# EAGLE schematic GDPHS_VGA - v1.3 (EAGLE 7.3.0)

## Sheet 1 of 4
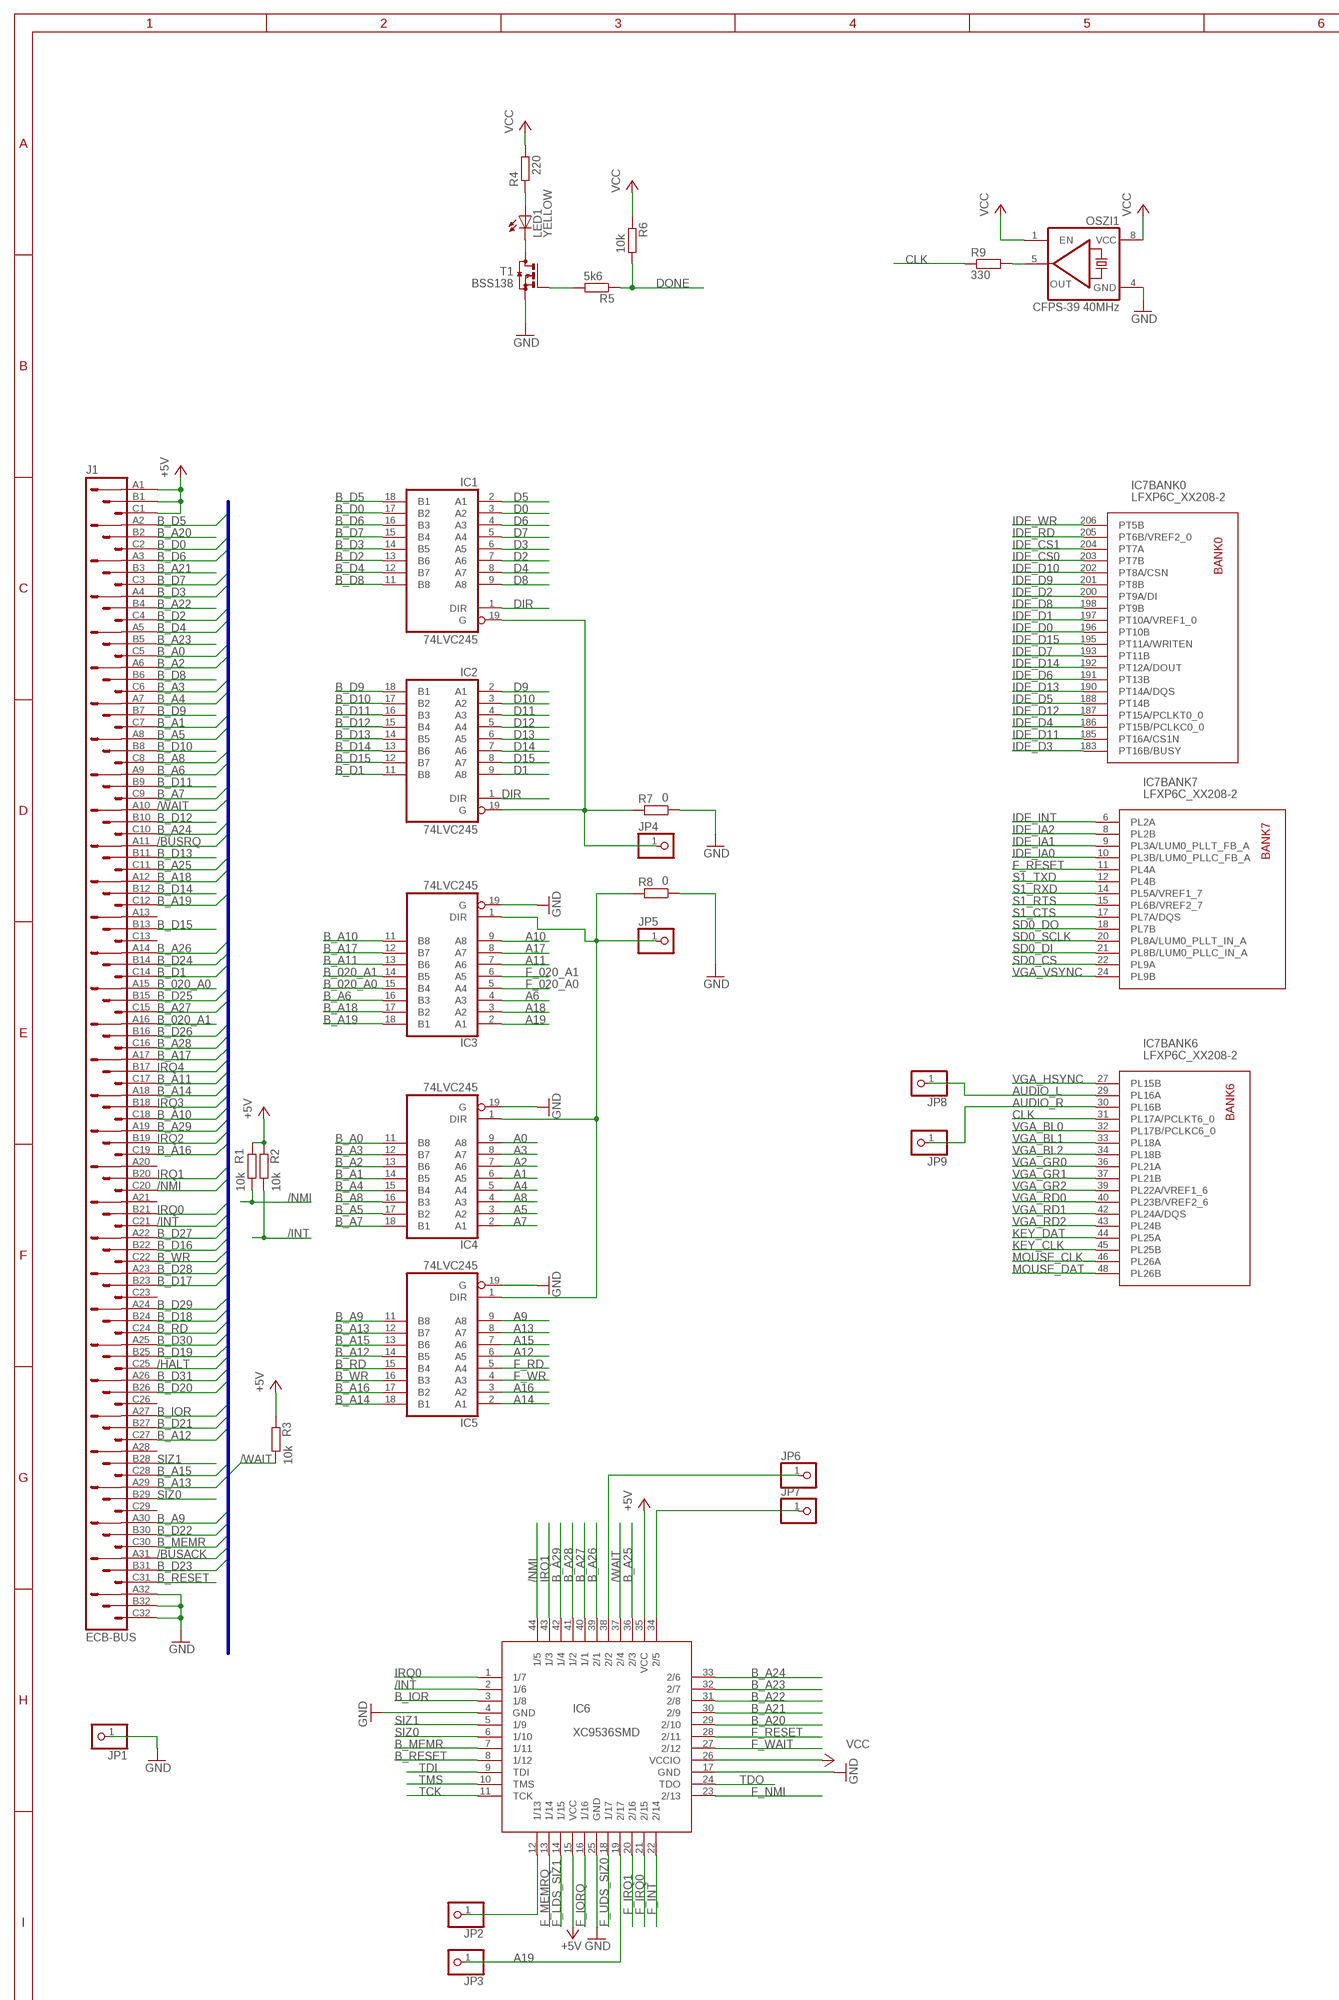
[diagram p0: schematic, sheet 1, part 1 of 2]
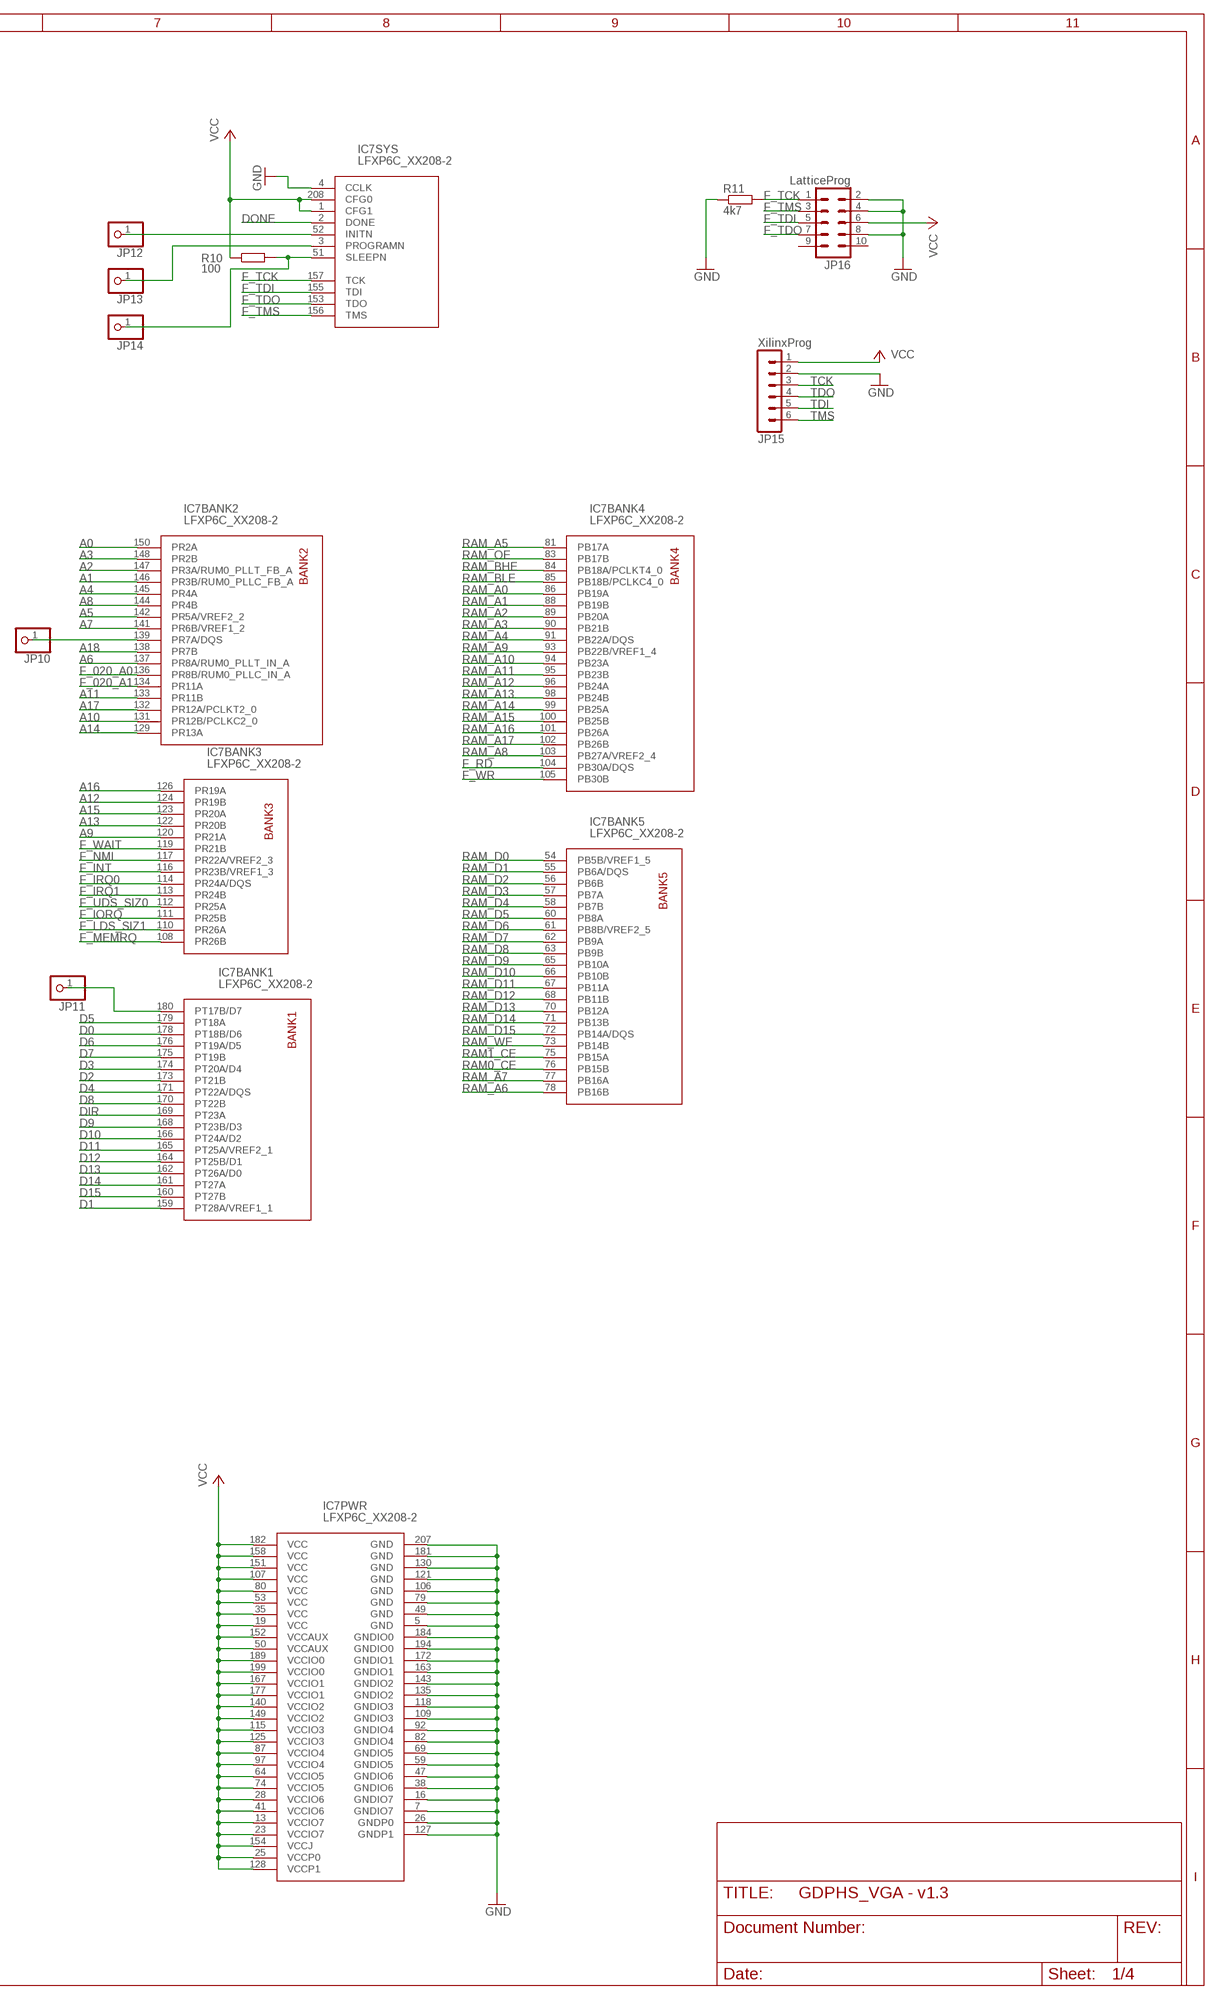
[diagram p1: schematic, sheet 1, part 2 of 2]

### Parts
IC1  74LVC245  74HCT245DW  [SO20W]
IC2  74LVC245  74HCT245DW  [SO20W]
IC3  74LVC245  74HCT245DW  [SO20W]
IC4  74LVC245  74HCT245DW  [SO20W]
IC5  74LVC245  74HCT245DW  [SO20W]
IC6  XC9536SMD  [TQFP44]
IC7  LFXP6C_XX208-2  [PQFP_208]
J1  ECB-BUS  VG96K  [VG96K]
JP1  PINHD-1X1  [1X01]
JP2  PINHD-1X1  [1X01]
JP3  PINHD-1X1  [1X01]
JP4  PINHD-1X1  [1X01]
JP5  PINHD-1X1  [1X01]
JP6  PINHD-1X1  [1X01]
JP7  PINHD-1X1  [1X01]
JP8  PINHD-1X1  [1X01]
JP9  PINHD-1X1  [1X01]
JP10  PINHD-1X1  [1X01]
JP11  PINHD-1X1  [1X01]
JP12  PINHD-1X1  [1X01]
JP13  PINHD-1X1  [1X01]
JP14  PINHD-1X1  [1X01]
JP15  XilinxProg  MA06-1  [MA06-1]
JP16  LatticeProg  MA05-2  [MA05-2]
LED1  YELLOW  LEDCHIPLED_0805  [CHIPLED_0805]
OSZI1  CFPS-39 40MHz  CRYSTAL_RESONATORCFPS7X  [CFPS7X]
R1  10k  R-EU_M0805  [M0805]
R2  10k  R-EU_M0805  [M0805]
R3  10k  R-EU_M0805  [M0805]
R4  220  R-EU_M0805  [M0805]
R5  5k6  R-EU_M0805  [M0805]
R6  10k  R-EU_M0805  [M0805]
R7  0  R-EU_M0805  [M0805]
R8  0  R-EU_M0805  [M0805]
R9  330  R-EU_M0805  [M0805]
R10  100  R-EU_M0805  [M0805]
R11  4k7  R-EU_M0805  [M0805]
T1  BSS138  BSS123  [SOT23]

### Nets
$34: IC6.38(2/2) JP6.1
+5V: IC6.15(VCC) IC6.35(VCC) J1.A1 J1.B1 J1.C1 R1.2 R2.2 R3.2 ; also sheet 2,3
/BUSACK: J1.A31
/BUSRQ: J1.A11
/HALT: J1.C25
/INT: IC6.2(1/6) J1.C21 R2.1
/NMI: IC6.44(1/5) J1.C20 R1.1
/WAIT: IC6.37(2/4) J1.A10 R3.1
A0: IC4.9(A8) IC7.150(BANK2:PR2A)
A1: IC4.6(A5) IC7.146(BANK2:PR3B/RUM0_PLLC_FB_A)
A2: IC4.7(A6) IC7.147(BANK2:PR3A/RUM0_PLLT_FB_A)
A3: IC4.8(A7) IC7.148(BANK2:PR2B)
A4: IC4.5(A4) IC7.145(BANK2:PR4A)
A5: IC4.3(A2) IC7.142(BANK2:PR5A/VREF2_2)
A6: IC3.4(A3) IC7.137(BANK2:PR8A/RUM0_PLLT_IN_A)
A7: IC4.2(A1) IC7.141(BANK2:PR6B/VREF1_2)
A8: IC4.4(A3) IC7.144(BANK2:PR4B)
A9: IC5.9(A8) IC7.120(BANK3:PR21A)
A10: IC3.9(A8) IC7.131(BANK2:PR12B/PCLKC2_0)
A11: IC3.7(A6) IC7.133(BANK2:PR11B)
A12: IC5.6(A5) IC7.124(BANK3:PR19B)
A13: IC5.8(A7) IC7.122(BANK3:PR20B)
A14: IC5.2(A1) IC7.129(BANK2:PR13A)
A15: IC5.7(A6) IC7.123(BANK3:PR20A)
A16: IC5.3(A2) IC7.126(BANK3:PR19A)
A17: IC3.8(A7) IC7.132(BANK2:PR12A/PCLKT2_0)
A18: IC3.3(A2) IC7.138(BANK2:PR7B)
A19: IC3.2(A1) IC6.19(2/17) JP3.1
AUDIO_L: IC7.29(BANK6:PL16A) JP8.1 ; also sheet 3
AUDIO_R: IC7.30(BANK6:PL16B) JP9.1 ; also sheet 3
B_020_A0: IC3.15(B4) J1.A15
B_020_A1: IC3.14(B5) J1.A16
B_A0: IC4.11(B8) J1.C5
B_A1: IC4.14(B5) J1.C7
B_A2: IC4.13(B6) J1.A6
B_A3: IC4.12(B7) J1.C6
B_A4: IC4.15(B4) J1.A7
B_A5: IC4.17(B2) J1.A8
B_A6: IC3.16(B3) J1.A9
B_A7: IC4.18(B1) J1.C9
B_A8: IC4.16(B3) J1.C8
B_A9: IC5.11(B8) J1.A30
B_A10: IC3.11(B8) J1.C18
B_A11: IC3.13(B6) J1.C17
B_A12: IC5.14(B5) J1.C27
B_A13: IC5.12(B7) J1.A29
B_A14: IC5.18(B1) J1.A18
B_A15: IC5.13(B6) J1.C28
B_A16: IC5.17(B2) J1.C19
B_A17: IC3.12(B7) J1.A17
B_A18: IC3.17(B2) J1.A12
B_A19: IC3.18(B1) J1.C12
B_A20: IC6.29(2/10) J1.B2
B_A21: IC6.30(2/9) J1.B3
B_A22: IC6.31(2/8) J1.B4
B_A23: IC6.32(2/7) J1.B5
B_A24: IC6.33(2/6) J1.C10
B_A25: IC6.36(2/3) J1.C11
B_A26: IC6.39(2/1) J1.A14
B_A27: IC6.40(1/1) J1.C15
B_A28: IC6.41(1/2) J1.C16
B_A29: IC6.42(1/4) J1.A19
B_D0: IC1.17(B2) J1.C2
B_D1: IC2.11(B8) J1.C14
B_D2: IC1.13(B6) J1.C4
B_D3: IC1.14(B5) J1.A4
B_D4: IC1.12(B7) J1.A5
B_D5: IC1.18(B1) J1.A2
B_D6: IC1.16(B3) J1.A3
B_D7: IC1.15(B4) J1.C3
B_D8: IC1.11(B8) J1.B6
B_D9: IC2.18(B1) J1.B7
B_D10: IC2.17(B2) J1.B8
B_D11: IC2.16(B3) J1.B9
B_D12: IC2.15(B4) J1.B10
B_D13: IC2.14(B5) J1.B11
B_D14: IC2.13(B6) J1.B12
B_D15: IC2.12(B7) J1.B13
B_D16: J1.B22
B_D17: J1.B23
B_D18: J1.B24
B_D19: J1.B25
B_D20: J1.B26
B_D21: J1.B27
B_D22: J1.B30
B_D23: J1.B31
B_D24: J1.B14
B_D25: J1.B15
B_D26: J1.B16
B_D27: J1.A22
B_D28: J1.A23
B_D29: J1.A24
B_D30: J1.A25
B_D31: J1.A26
B_IOR: IC6.3(1/8) J1.A27
B_MEMR: IC6.7(1/11) J1.C30
B_RD: IC5.15(B4) J1.C24
B_RESET: IC6.8(1/12) J1.C31
B_WR: IC5.16(B3) J1.C22
CLK: IC7.31(BANK6:PL17A/PCLKT6_0) R9.1
D0: IC1.3(A2) IC7.178(BANK1:PT18B/D6)
D1: IC2.9(A8) IC7.159(BANK1:PT28A/VREF1_1)
D2: IC1.7(A6) IC7.173(BANK1:PT21B)
D3: IC1.6(A5) IC7.174(BANK1:PT20A/D4)
D4: IC1.8(A7) IC7.171(BANK1:PT22A/DQS)
D5: IC1.2(A1) IC7.179(BANK1:PT18A)
D6: IC1.4(A3) IC7.176(BANK1:PT19A/D5)
D7: IC1.5(A4) IC7.175(BANK1:PT19B)
D8: IC1.9(A8) IC7.170(BANK1:PT22B)
D9: IC2.2(A1) IC7.168(BANK1:PT23B/D3)
D10: IC2.3(A2) IC7.166(BANK1:PT24A/D2)
D11: IC2.4(A3) IC7.165(BANK1:PT25A/VREF2_1)
D12: IC2.5(A4) IC7.164(BANK1:PT25B/D1)
D13: IC2.6(A5) IC7.162(BANK1:PT26A/D0)
D14: IC2.7(A6) IC7.161(BANK1:PT27A)
D15: IC2.8(A7) IC7.160(BANK1:PT27B)
DIR: IC1.1(DIR) IC2.1(DIR) IC7.169(BANK1:PT23A)
DONE: IC7.2(SYS:DONE) R5.1 R6.2
F_020_A0: IC3.5(A4) IC7.136(BANK2:PR8B/RUM0_PLLC_IN_A)
F_020_A1: IC3.6(A5) IC7.134(BANK2:PR11A)
F_INT: IC6.22(2/14) IC7.116(BANK3:PR23B/VREF1_3)
F_IORQ: IC6.16(1/16) IC7.111(BANK3:PR25B)
F_IRQ0: IC6.21(2/15) IC7.114(BANK3:PR24A/DQS)
F_IRQ1: IC6.20(2/16) IC7.113(BANK3:PR24B)
F_LDS_SIZ1: IC6.14(1/15) IC7.110(BANK3:PR26A)
F_MEMRQ: IC6.13(1/14) IC7.108(BANK3:PR26B)
F_NMI: IC6.23(2/13) IC7.117(BANK3:PR22A/VREF2_3)
F_RD: IC5.5(A4) IC7.104(BANK4:PB30A/DQS)
F_RESET: IC6.28(2/11) IC7.11(BANK7:PL4A) ; also sheet 3
F_TCK: IC7.157(SYS:TCK) JP16.1 R11.2
F_TDI: IC7.155(SYS:TDI) JP16.5
F_TDO: IC7.153(SYS:TDO) JP16.7
F_TMS: IC7.156(SYS:TMS) JP16.3
F_UDS_SIZ0: IC6.18(1/17) IC7.112(BANK3:PR25A)
F_WAIT: IC6.27(2/12) IC7.119(BANK3:PR21B)
F_WR: IC5.4(A3) IC7.105(BANK4:PB30B)
GND: IC3.19(G) IC4.19(G) IC5.19(G) IC6.4(GND) IC6.17(GND) IC6.25(GND) IC7.4(SYS:CCLK) IC7.5(PWR:GND) IC7.7(PWR:GNDIO7) IC7.16(PWR:GNDIO7) IC7.26(PWR:GNDP0) IC7.38(PWR:GNDIO6) IC7.47(PWR:GNDIO6) IC7.49(PWR:GND) IC7.59(PWR:GNDIO5) IC7.69(PWR:GNDIO5) IC7.79(PWR:GND) IC7.82(PWR:GNDIO4) IC7.92(PWR:GNDIO4) IC7.106(PWR:GND) IC7.109(PWR:GNDIO3) IC7.118(PWR:GNDIO3) IC7.121(PWR:GND) IC7.127(PWR:GNDP1) IC7.130(PWR:GND) IC7.135(PWR:GNDIO2) IC7.143(PWR:GNDIO2) IC7.163(PWR:GNDIO1) IC7.172(PWR:GNDIO1) IC7.181(PWR:GND) IC7.184(PWR:GNDIO0) IC7.194(PWR:GNDIO0) IC7.207(PWR:GND) J1.A32 J1.B32 J1.C32 JP1.1 JP15.2 JP16.2 JP16.4 JP16.8 OSZI1.4(GND) R7.1 R8.1 R11.1 T1.2(S) ; also sheet 2,3
IDE_CS0: IC7.203(BANK0:PT7B) ; also sheet 3
IDE_CS1: IC7.204(BANK0:PT7A) ; also sheet 3
IDE_D0: IC7.196(BANK0:PT10B) ; also sheet 3
IDE_D1: IC7.197(BANK0:PT10A/VREF1_0) ; also sheet 3
IDE_D2: IC7.200(BANK0:PT9A/DI) ; also sheet 3
IDE_D3: IC7.183(BANK0:PT16B/BUSY) ; also sheet 3
IDE_D4: IC7.186(BANK0:PT15B/PCLKC0_0) ; also sheet 3
IDE_D5: IC7.188(BANK0:PT14B) ; also sheet 3
IDE_D6: IC7.191(BANK0:PT13B) ; also sheet 3
IDE_D7: IC7.193(BANK0:PT11B) ; also sheet 3
IDE_D8: IC7.198(BANK0:PT9B) ; also sheet 3
IDE_D9: IC7.201(BANK0:PT8B) ; also sheet 3
IDE_D10: IC7.202(BANK0:PT8A/CSN) ; also sheet 3
IDE_D11: IC7.185(BANK0:PT16A/CS1N) ; also sheet 3
IDE_D12: IC7.187(BANK0:PT15A/PCLKT0_0) ; also sheet 3
IDE_D13: IC7.190(BANK0:PT14A/DQS) ; also sheet 3
IDE_D14: IC7.192(BANK0:PT12A/DOUT) ; also sheet 3
IDE_D15: IC7.195(BANK0:PT11A/WRITEN) ; also sheet 3
IDE_IA0: IC7.10(BANK7:PL3B/LUM0_PLLC_FB_A) ; also sheet 3
IDE_IA1: IC7.9(BANK7:PL3A/LUM0_PLLT_FB_A) ; also sheet 3
IDE_IA2: IC7.8(BANK7:PL2B) ; also sheet 3
IDE_INT: IC7.6(BANK7:PL2A) ; also sheet 3
IDE_RD: IC7.205(BANK0:PT6B/VREF2_0) ; also sheet 3
IDE_WR: IC7.206(BANK0:PT5B) ; also sheet 3
IRQ0: IC6.1(1/7) J1.B21
IRQ1: IC6.43(1/3) J1.B20
IRQ2: J1.B19
IRQ3: J1.B18
IRQ4: J1.B17
KEY_CLK: IC7.45(BANK6:PL25B) ; also sheet 3
KEY_DAT: IC7.44(BANK6:PL25A) ; also sheet 3
MOUSE_CLK: IC7.46(BANK6:PL26A) ; also sheet 3
MOUSE_DAT: IC7.48(BANK6:PL26B) ; also sheet 3
N$5: OSZI1.5(OUT) R9.2
N$16: LED1.A R4.1
N$24: IC7.51(SYS:SLEEPN) JP14.1 R10.2
N$25: R5.2 T1.1(G)
N$26: LED1.C T1.3(D)
N$31: IC7.139(BANK2:PR7A/DQS) JP10.1
N$32: IC6.34(2/5) JP7.1
N$33: IC6.12(1/13) JP2.1
N$36: IC7.52(SYS:INITN) JP12.1
N$37: IC7.3(SYS:PROGRAMN) JP13.1
N$41: IC3.1(DIR) IC4.1(DIR) IC5.1(DIR) JP5.1 R8.2
N$42: IC1.19(G) IC2.19(G) JP4.1 R7.2
N$49: IC7.180(BANK1:PT17B/D7) JP11.1
RAM0_CE: IC7.76(BANK5:PB15B) ; also sheet 2
RAM1_CE: IC7.75(BANK5:PB15A) ; also sheet 2
RAM_A0: IC7.86(BANK4:PB19A) ; also sheet 2
RAM_A1: IC7.88(BANK4:PB19B) ; also sheet 2
RAM_A2: IC7.89(BANK4:PB20A) ; also sheet 2
RAM_A3: IC7.90(BANK4:PB21B) ; also sheet 2
RAM_A4: IC7.91(BANK4:PB22A/DQS) ; also sheet 2
RAM_A5: IC7.81(BANK4:PB17A) ; also sheet 2
RAM_A6: IC7.78(BANK5:PB16B) ; also sheet 2
RAM_A7: IC7.77(BANK5:PB16A) ; also sheet 2
RAM_A8: IC7.103(BANK4:PB27A/VREF2_4) ; also sheet 2
RAM_A9: IC7.93(BANK4:PB22B/VREF1_4) ; also sheet 2
RAM_A10: IC7.94(BANK4:PB23A) ; also sheet 2
RAM_A11: IC7.95(BANK4:PB23B) ; also sheet 2
RAM_A12: IC7.96(BANK4:PB24A) ; also sheet 2
RAM_A13: IC7.98(BANK4:PB24B) ; also sheet 2
RAM_A14: IC7.99(BANK4:PB25A) ; also sheet 2
RAM_A15: IC7.100(BANK4:PB25B) ; also sheet 2
RAM_A16: IC7.101(BANK4:PB26A) ; also sheet 2
RAM_A17: IC7.102(BANK4:PB26B) ; also sheet 2
RAM_BHE: IC7.84(BANK4:PB18A/PCLKT4_0) ; also sheet 2
RAM_BLE: IC7.85(BANK4:PB18B/PCLKC4_0) ; also sheet 2
RAM_D0: IC7.54(BANK5:PB5B/VREF1_5) ; also sheet 2
RAM_D1: IC7.55(BANK5:PB6A/DQS) ; also sheet 2
RAM_D2: IC7.56(BANK5:PB6B) ; also sheet 2
RAM_D3: IC7.57(BANK5:PB7A) ; also sheet 2
RAM_D4: IC7.58(BANK5:PB7B) ; also sheet 2
RAM_D5: IC7.60(BANK5:PB8A) ; also sheet 2
RAM_D6: IC7.61(BANK5:PB8B/VREF2_5) ; also sheet 2
RAM_D7: IC7.62(BANK5:PB9A) ; also sheet 2
RAM_D8: IC7.63(BANK5:PB9B) ; also sheet 2
RAM_D9: IC7.65(BANK5:PB10A) ; also sheet 2
RAM_D10: IC7.66(BANK5:PB10B) ; also sheet 2
RAM_D11: IC7.67(BANK5:PB11A) ; also sheet 2
RAM_D12: IC7.68(BANK5:PB11B) ; also sheet 2
RAM_D13: IC7.70(BANK5:PB12A) ; also sheet 2
RAM_D14: IC7.71(BANK5:PB13B) ; also sheet 2
RAM_D15: IC7.72(BANK5:PB14A/DQS) ; also sheet 2
RAM_OE: IC7.83(BANK4:PB17B) ; also sheet 2
RAM_WE: IC7.73(BANK5:PB14B) ; also sheet 2
S1_CTS: IC7.17(BANK7:PL7A/DQS) ; also sheet 3
S1_RTS: IC7.15(BANK7:PL6B/VREF2_7) ; also sheet 3
S1_RXD: IC7.14(BANK7:PL5A/VREF1_7) ; also sheet 3
S1_TXD: IC7.12(BANK7:PL4B) ; also sheet 3
SD0_CS: IC7.22(BANK7:PL9A) ; also sheet 3
SD0_DI: IC7.21(BANK7:PL8B/LUM0_PLLC_IN_A) ; also sheet 3
SD0_DO: IC7.18(BANK7:PL7B) ; also sheet 3
SD0_SCLK: IC7.20(BANK7:PL8A/LUM0_PLLT_IN_A) ; also sheet 3
SIZ0: IC6.6(1/10) J1.B29
SIZ1: IC6.5(1/9) J1.B28
TCK: IC6.11(TCK) JP15.3
TDI: IC6.9(TDI) JP15.5
TDO: IC6.24(TDO) JP15.4
TMS: IC6.10(TMS) JP15.6
VCC: IC6.26(VCCIO) IC7.1(SYS:CFG1) IC7.13(PWR:VCCIO7) IC7.19(PWR:VCC) IC7.23(PWR:VCCIO7) IC7.25(PWR:VCCP0) IC7.28(PWR:VCCIO6) IC7.35(PWR:VCC) IC7.41(PWR:VCCIO6) IC7.50(PWR:VCCAUX) IC7.53(PWR:VCC) IC7.64(PWR:VCCIO5) IC7.74(PWR:VCCIO5) IC7.80(PWR:VCC) IC7.87(PWR:VCCIO4) IC7.97(PWR:VCCIO4) IC7.107(PWR:VCC) IC7.115(PWR:VCCIO3) IC7.125(PWR:VCCIO3) IC7.128(PWR:VCCP1) IC7.140(PWR:VCCIO2) IC7.149(PWR:VCCIO2) IC7.151(PWR:VCC) IC7.152(PWR:VCCAUX) IC7.154(PWR:VCCJ) IC7.158(PWR:VCC) IC7.167(PWR:VCCIO1) IC7.177(PWR:VCCIO1) IC7.182(PWR:VCC) IC7.189(PWR:VCCIO0) IC7.199(PWR:VCCIO0) IC7.208(SYS:CFG0) JP15.1 JP16.6 OSZI1.1(EN) OSZI1.8(VCC) R4.2 R6.1 R10.1 ; also sheet 2,3
VGA_BL0: IC7.32(BANK6:PL17B/PCLKC6_0) ; also sheet 3
VGA_BL1: IC7.33(BANK6:PL18A) ; also sheet 3
VGA_BL2: IC7.34(BANK6:PL18B) ; also sheet 3
VGA_GR0: IC7.36(BANK6:PL21A) ; also sheet 3
VGA_GR1: IC7.37(BANK6:PL21B) ; also sheet 3
VGA_GR2: IC7.39(BANK6:PL22A/VREF1_6) ; also sheet 3
VGA_HSYNC: IC7.27(BANK6:PL15B) ; also sheet 3
VGA_RD0: IC7.40(BANK6:PL23B/VREF2_6) ; also sheet 3
VGA_RD1: IC7.42(BANK6:PL24A/DQS) ; also sheet 3
VGA_RD2: IC7.43(BANK6:PL24B) ; also sheet 3
VGA_VSYNC: IC7.24(BANK7:PL9B) ; also sheet 3
Unconnected: J1.A13 J1.A20 J1.A21 J1.A28 J1.C13 J1.C23 J1.C26 J1.C29 JP16.9 JP16.10

### Buses
B_D[0..31],B_A[0..31],IRQ[0..7],B_BANK,B_HALT,B_RD,B_WR,B_IOR,B_MEMR,B_M1,B_RFSH,B_BACK,/INT,/NMI,/RESET,/WAIT,/BUSRQ,CLK,/BUSACK,/HALT

## Sheet 2 of 4
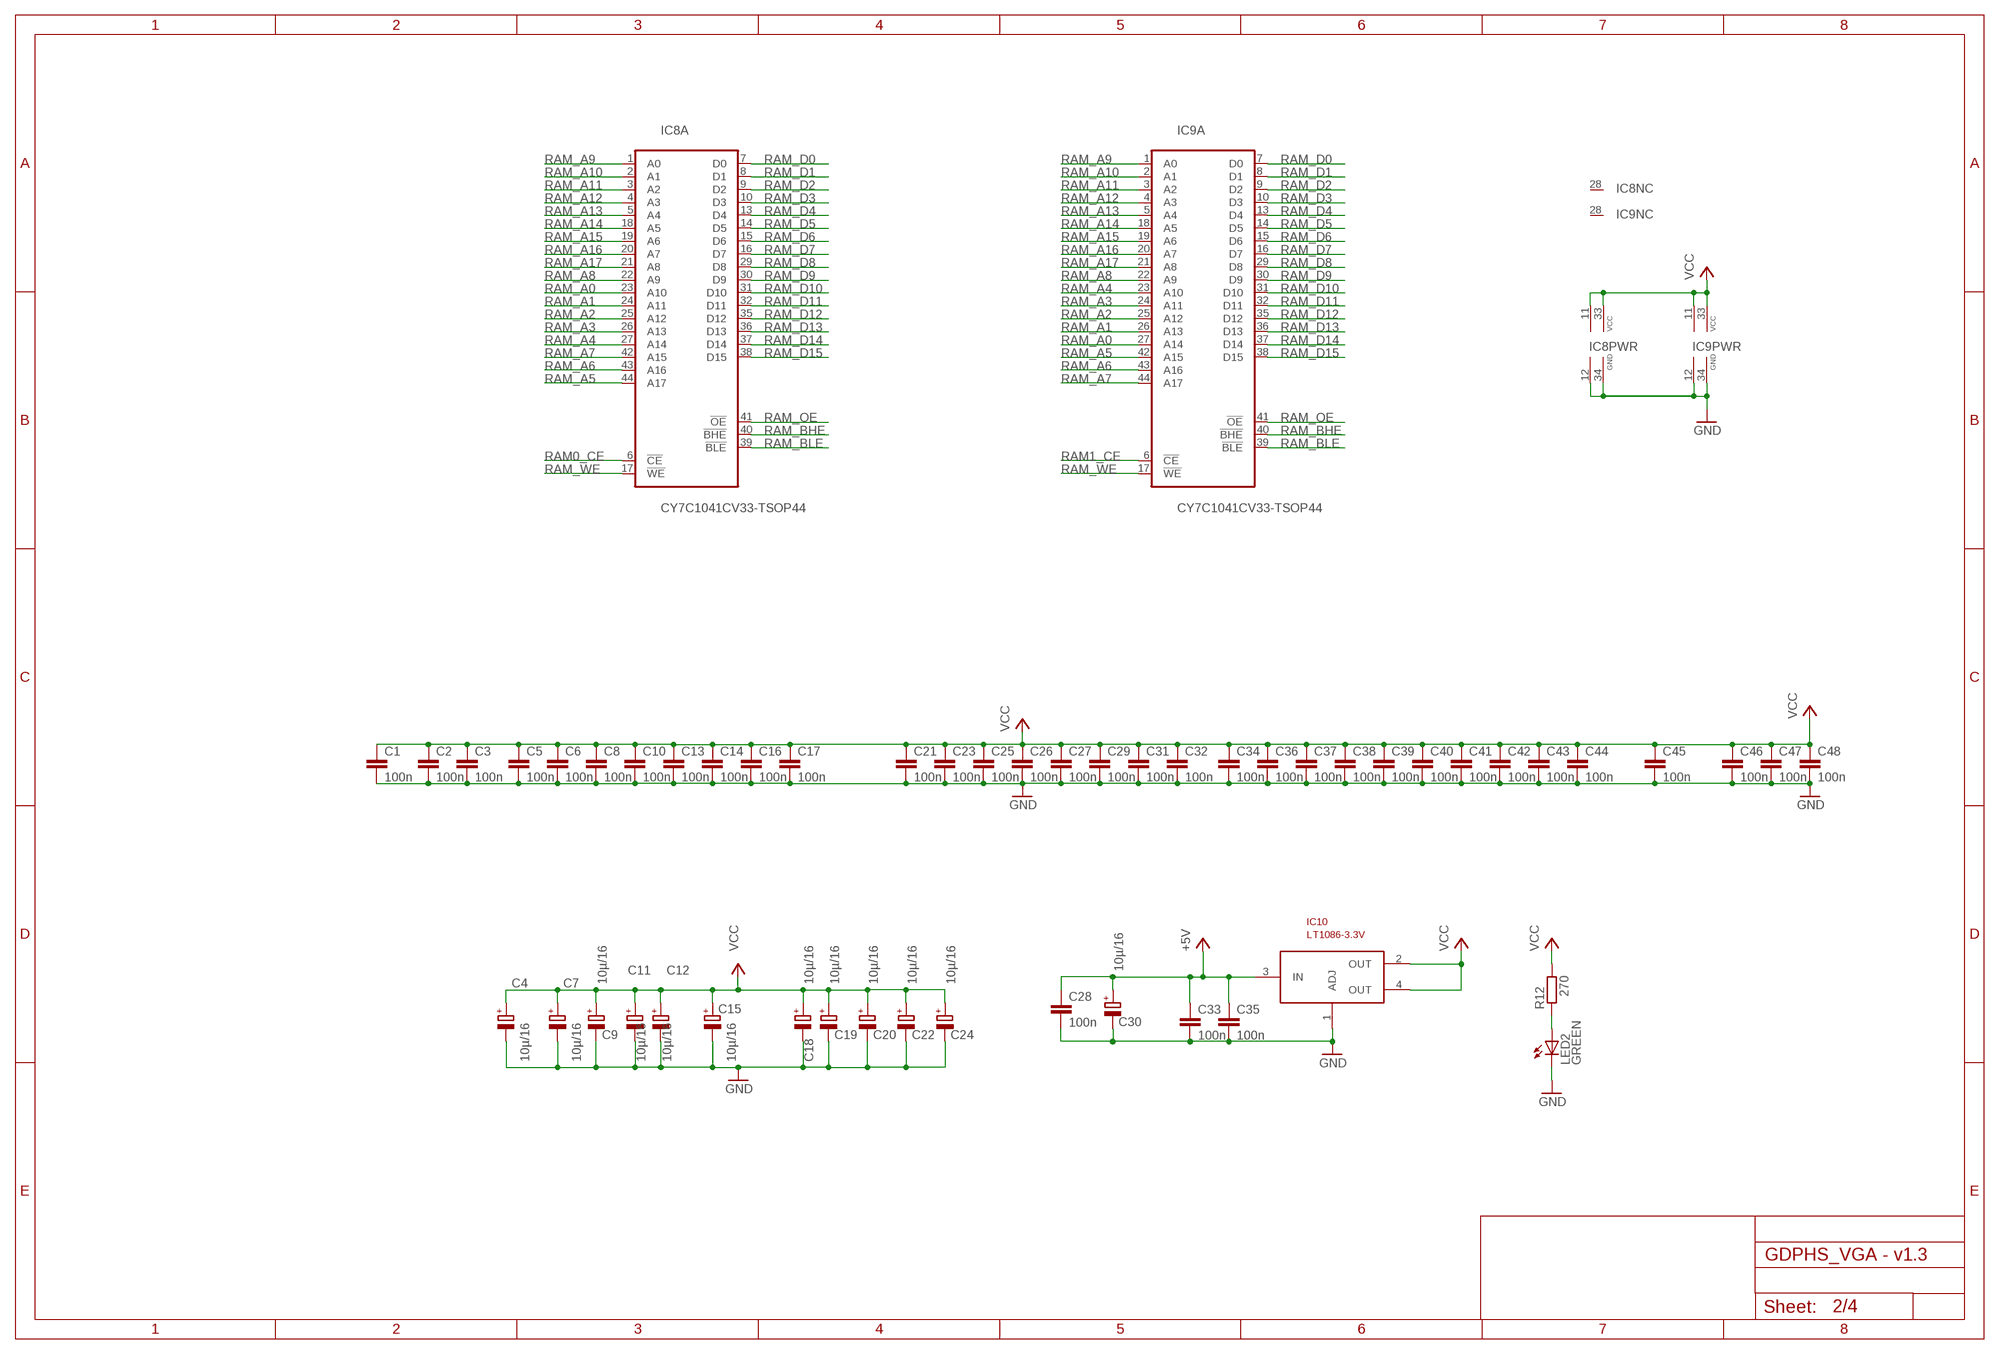
[diagram p2: schematic, sheet 2]

### Parts
C1  100n  C-EUC0805  [C0805]
C2  100n  C-EUC0805  [C0805]
C3  100n  C-EUC0805  [C0805]
C4  10µ/16  CPOL-EUSMCC  [SMC_C]
C5  100n  C-EUC0805  [C0805]
C6  100n  C-EUC0805  [C0805]
C7  10µ/16  CPOL-EUSMCC  [SMC_C]
C8  100n  C-EUC0805  [C0805]
C9  10µ/16  CPOL-EUSMCC  [SMC_C]
C10  100n  C-EUC0805  [C0805]
C11  10µ/16  CPOL-EUSMCC  [SMC_C]
C12  10µ/16  CPOL-EUSMCC  [SMC_C]
C13  100n  C-EUC0805  [C0805]
C14  100n  C-EUC0805  [C0805]
C15  10µ/16  CPOL-EUSMCC  [SMC_C]
C16  100n  C-EUC0805  [C0805]
C17  100n  C-EUC0805  [C0805]
C18  10µ/16  CPOL-EUSMCC  [SMC_C]
C19  10µ/16  CPOL-EUSMCC  [SMC_C]
C20  10µ/16  CPOL-EUSMCC  [SMC_C]
C21  100n  C-EUC0805  [C0805]
C22  10µ/16  CPOL-EUSMCC  [SMC_C]
C23  100n  C-EUC0805  [C0805]
C24  10µ/16  CPOL-EUSMCC  [SMC_C]
C25  100n  C-EUC0805  [C0805]
C26  100n  C-EUC0805  [C0805]
C27  100n  C-EUC0805  [C0805]
C28  100n  C-EUC0805  [C0805]
C29  100n  C-EUC0805  [C0805]
C30  10µ/16  CPOL-EUSMCC  [SMC_C]
C31  100n  C-EUC0805  [C0805]
C32  100n  C-EUC0805  [C0805]
C33  100n  C-EUC0805  [C0805]
C34  100n  C-EUC0805  [C0805]
C35  100n  C-EUC0805  [C0805]
C36  100n  C-EUC0805  [C0805]
C37  100n  C-EUC0805  [C0805]
C38  100n  C-EUC0805  [C0805]
C39  100n  C-EUC0805  [C0805]
C40  100n  C-EUC0805  [C0805]
C41  100n  C-EUC0805  [C0805]
C42  100n  C-EUC0805  [C0805]
C43  100n  C-EUC0805  [C0805]
C44  100n  C-EUC0805  [C0805]
C45  100n  C-EUC0805  [C0805]
C46  100n  C-EUC0805  [C0805]
C47  100n  C-EUC0805  [C0805]
C48  100n  C-EUC0805  [C0805]
IC8  CY7C1041CV33-TSOP44  [TSOP44-400]
IC9  CY7C1041CV33-TSOP44  [TSOP44-400]
IC10  LT1086-3.3V  LT1086  [MDD]
LED2  GREEN  LEDCHIPLED_0805  [CHIPLED_0805]
R12  270  R-EU_M0805  [M0805]

### Nets
+5V: C28.1 C30.+ C33.1 C35.1 IC10.3(IN) ; also sheet 1,3
GND: C1.2 C2.2 C3.2 C4.- C5.2 C6.2 C7.- C8.2 C9.- C10.2 C11.- C12.- C13.2 C14.2 C15.- C16.2 C17.2 C18.- C19.- C20.- C21.2 C22.- C23.2 C24.- C25.2 C26.2 C27.2 C28.2 C29.2 C30.- C31.2 C32.2 C33.2 C34.2 C35.2 C36.2 C37.2 C38.2 C39.2 C40.2 C41.2 C42.2 C43.2 C44.2 C45.2 C46.2 C47.2 C48.2 IC8.12(PWR:GND) IC8.34(PWR:GND) IC9.12(PWR:GND) IC9.34(PWR:GND) IC10.1(ADJ) LED2.C ; also sheet 1,3
N$15: LED2.A R12.1
RAM0_CE: IC8.6(A:!CE) ; also sheet 1
RAM1_CE: IC9.6(A:!CE) ; also sheet 1
RAM_A0: IC8.23(A:A10) IC9.27(A:A14) ; also sheet 1
RAM_A1: IC8.24(A:A11) IC9.26(A:A13) ; also sheet 1
RAM_A2: IC8.25(A:A12) IC9.25(A:A12) ; also sheet 1
RAM_A3: IC8.26(A:A13) IC9.24(A:A11) ; also sheet 1
RAM_A4: IC8.27(A:A14) IC9.23(A:A10) ; also sheet 1
RAM_A5: IC8.44(A:A17) IC9.42(A:A15) ; also sheet 1
RAM_A6: IC8.43(A:A16) IC9.43(A:A16) ; also sheet 1
RAM_A7: IC8.42(A:A15) IC9.44(A:A17) ; also sheet 1
RAM_A8: IC8.22(A:A9) IC9.22(A:A9) ; also sheet 1
RAM_A9: IC8.1(A:A0) IC9.1(A:A0) ; also sheet 1
RAM_A10: IC8.2(A:A1) IC9.2(A:A1) ; also sheet 1
RAM_A11: IC8.3(A:A2) IC9.3(A:A2) ; also sheet 1
RAM_A12: IC8.4(A:A3) IC9.4(A:A3) ; also sheet 1
RAM_A13: IC8.5(A:A4) IC9.5(A:A4) ; also sheet 1
RAM_A14: IC8.18(A:A5) IC9.18(A:A5) ; also sheet 1
RAM_A15: IC8.19(A:A6) IC9.19(A:A6) ; also sheet 1
RAM_A16: IC8.20(A:A7) IC9.20(A:A7) ; also sheet 1
RAM_A17: IC8.21(A:A8) IC9.21(A:A8) ; also sheet 1
RAM_BHE: IC8.40(A:!BHE) IC9.40(A:!BHE) ; also sheet 1
RAM_BLE: IC8.39(A:!BLE) IC9.39(A:!BLE) ; also sheet 1
RAM_D0: IC8.7(A:D0) IC9.7(A:D0) ; also sheet 1
RAM_D1: IC8.8(A:D1) IC9.8(A:D1) ; also sheet 1
RAM_D2: IC8.9(A:D2) IC9.9(A:D2) ; also sheet 1
RAM_D3: IC8.10(A:D3) IC9.10(A:D3) ; also sheet 1
RAM_D4: IC8.13(A:D4) IC9.13(A:D4) ; also sheet 1
RAM_D5: IC8.14(A:D5) IC9.14(A:D5) ; also sheet 1
RAM_D6: IC8.15(A:D6) IC9.15(A:D6) ; also sheet 1
RAM_D7: IC8.16(A:D7) IC9.16(A:D7) ; also sheet 1
RAM_D8: IC8.29(A:D8) IC9.29(A:D8) ; also sheet 1
RAM_D9: IC8.30(A:D9) IC9.30(A:D9) ; also sheet 1
RAM_D10: IC8.31(A:D10) IC9.31(A:D10) ; also sheet 1
RAM_D11: IC8.32(A:D11) IC9.32(A:D11) ; also sheet 1
RAM_D12: IC8.35(A:D12) IC9.35(A:D12) ; also sheet 1
RAM_D13: IC8.36(A:D13) IC9.36(A:D13) ; also sheet 1
RAM_D14: IC8.37(A:D14) IC9.37(A:D14) ; also sheet 1
RAM_D15: IC8.38(A:D15) IC9.38(A:D15) ; also sheet 1
RAM_OE: IC8.41(A:!OE) IC9.41(A:!OE) ; also sheet 1
RAM_WE: IC8.17(A:!WE) IC9.17(A:!WE) ; also sheet 1
VCC: C1.1 C2.1 C3.1 C4.+ C5.1 C6.1 C7.+ C8.1 C9.+ C10.1 C11.+ C12.+ C13.1 C14.1 C15.+ C16.1 C17.1 C18.+ C19.+ C20.+ C21.1 C22.+ C23.1 C24.+ C25.1 C26.1 C27.1 C29.1 C31.1 C32.1 C34.1 C36.1 C37.1 C38.1 C39.1 C40.1 C41.1 C42.1 C43.1 C44.1 C45.1 C46.1 C47.1 C48.1 IC8.11(PWR:VCC) IC8.33(PWR:VCC2) IC9.11(PWR:VCC) IC9.33(PWR:VCC2) IC10.2(OUT) IC10.4(OUT) R12.2 ; also sheet 1,3
Unconnected: IC8.28(NC:NC) IC9.28(NC:NC)

## Sheet 3 of 4
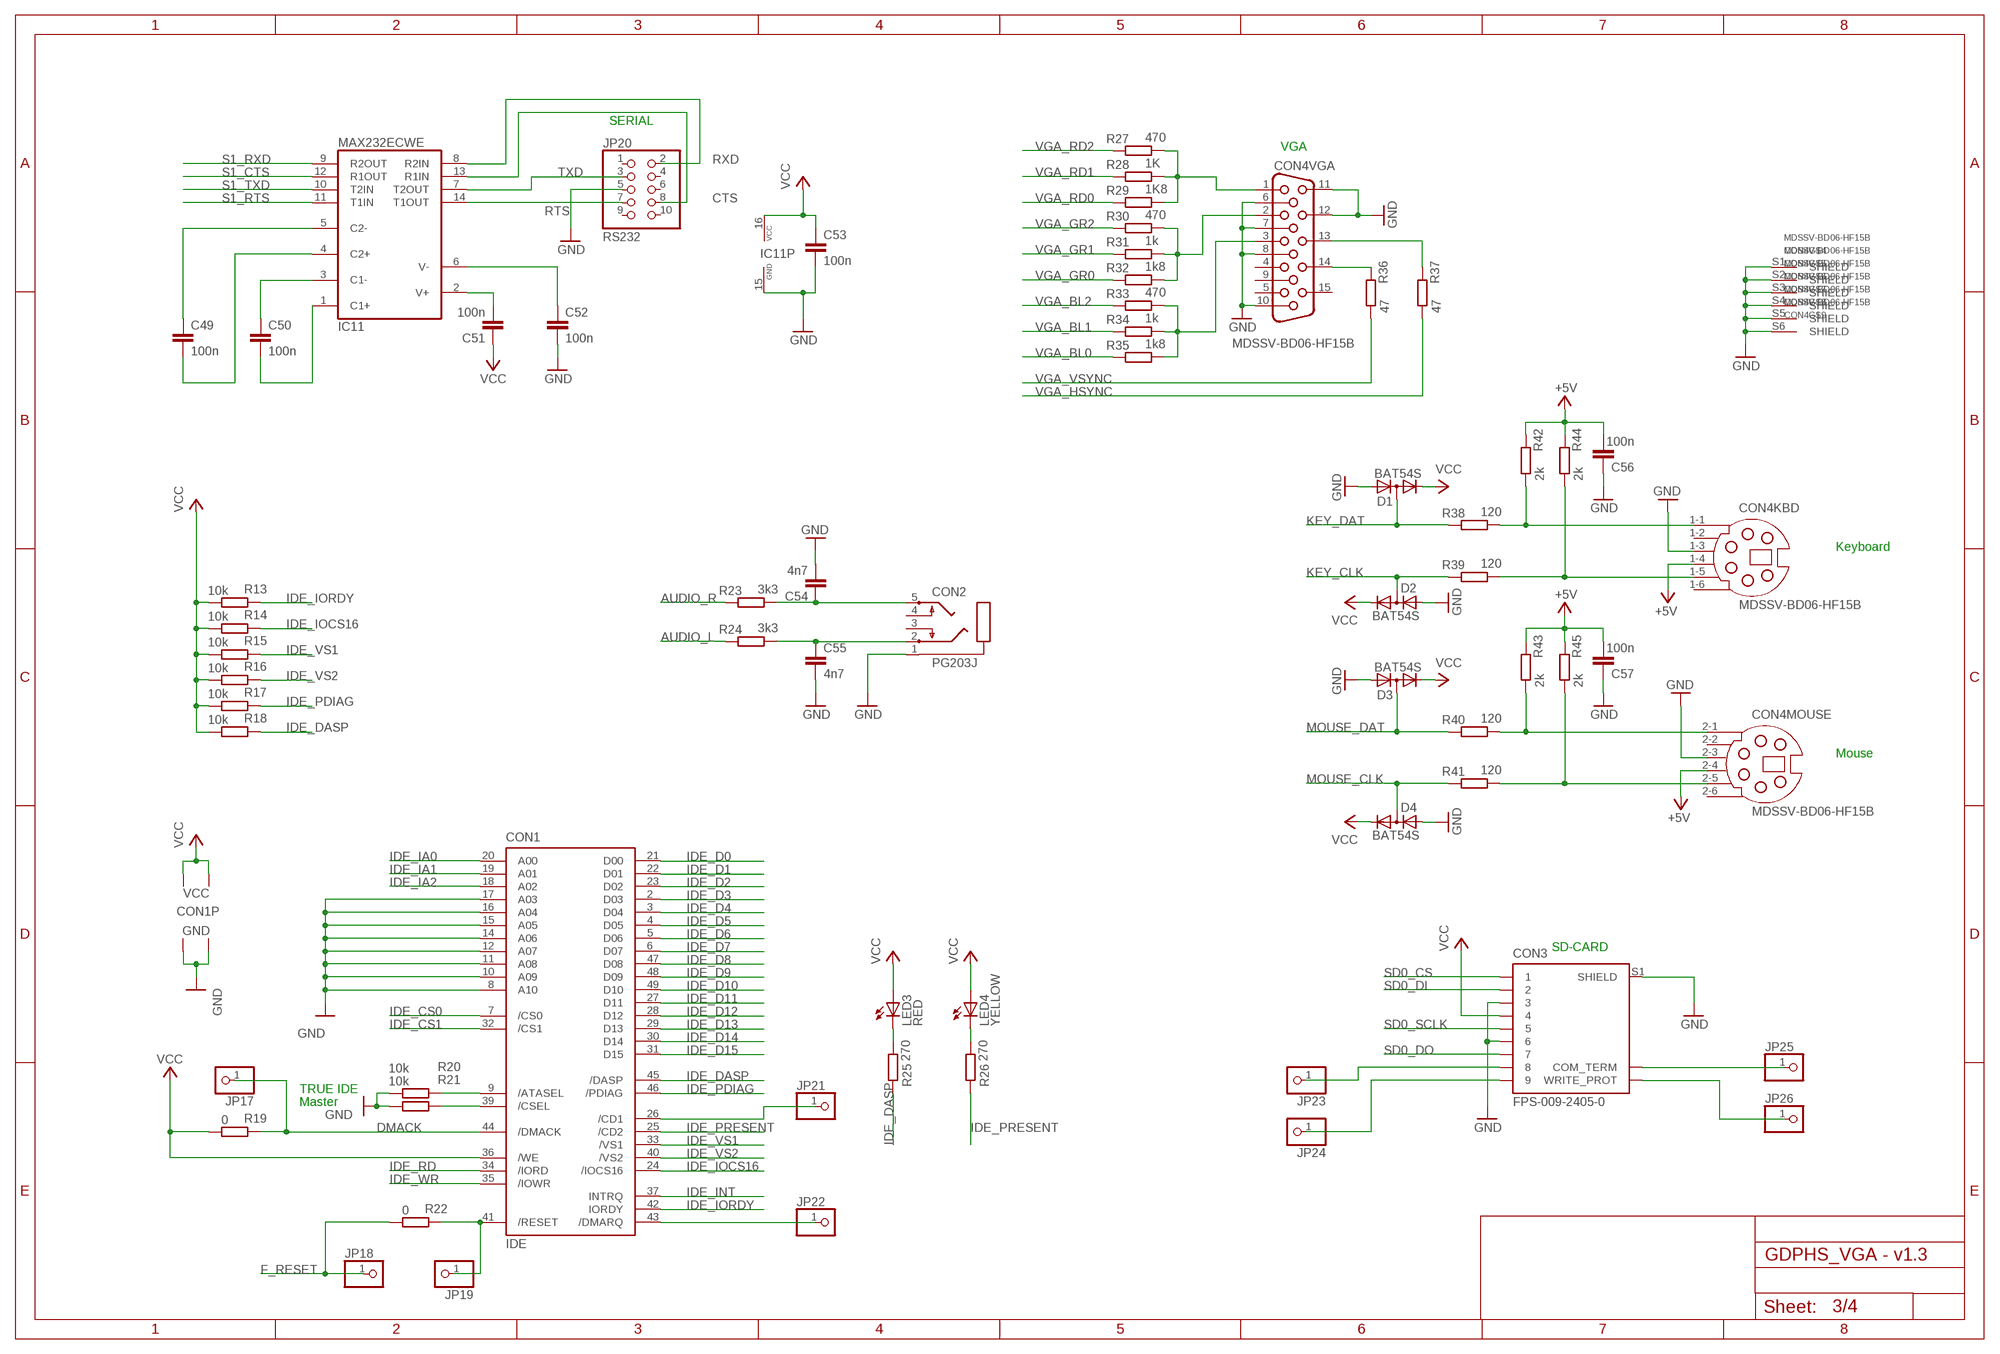
[diagram p3: schematic, sheet 3]

### Parts
C49  100n  C-EUC0805  [C0805]
C50  100n  C-EUC0805  [C0805]
C51  100n  C-EUC0805  [C0805]
C52  100n  C-EUC0805  [C0805]
C53  100n  C-EUC0805  [C0805]
C54  4n7  C-EUC0805  [C0805]
C55  4n7  C-EUC0805  [C0805]
C56  100n  C-EUC0805  [C0805]
C57  100n  C-EUC0805  [C0805]
CON1  IDE  CF-CARD-IDE_MODEYAMAI-CF-CARD-I-II  [CF-050-P2-X03-10-DS-1]
CON2  PG203J  [PG203J]
CON3  FPS-009-2405-0  [FPS-009-2405-0]
CON4  MDSSV-BD06-HF15B  [MDSSV-BD06-HF15-B]
D1  BAT54S  DIODE_2CACA-SOT23  [SOT23]
D2  BAT54S  DIODE_2CACA-SOT23  [SOT23]
D3  BAT54S  DIODE_2CACA-SOT23  [SOT23]
D4  BAT54S  DIODE_2CACA-SOT23  [SOT23]
IC11  MAX232ECWE  [SO16L]
JP17  PINHD-1X1  [1X01]
JP18  PINHD-1X1  [1X01]
JP19  PINHD-1X1  [1X01]
JP20  RS232  PINHD-2X5  [2X05]
JP21  PINHD-1X1  [1X01]
JP22  PINHD-1X1  [1X01]
JP23  PINHD-1X1  [1X01]
JP24  PINHD-1X1  [1X01]
JP25  PINHD-1X1  [1X01]
JP26  PINHD-1X1  [1X01]
LED3  RED  LEDCHIPLED_0805  [CHIPLED_0805]
LED4  YELLOW  LEDCHIPLED_0805  [CHIPLED_0805]
R13  10k  R-EU_M0805  [M0805]
R14  10k  R-EU_M0805  [M0805]
R15  10k  R-EU_M0805  [M0805]
R16  10k  R-EU_M0805  [M0805]
R17  10k  R-EU_M0805  [M0805]
R18  10k  R-EU_M0805  [M0805]
R19  0  R-EU_M0805  [M0805]
R20  10k  R-EU_M0805  [M0805]
R21  10k  R-EU_M0805  [M0805]
R22  0  R-EU_M0805  [M0805]
R23  3k3  R-EU_M0805  [M0805]
R24  3k3  R-EU_M0805  [M0805]
R25  270  R-EU_M0805  [M0805]
R26  270  R-EU_M0805  [M0805]
R27  470  R-EU_M0805  [M0805]
R28  1K  R-EU_M0805  [M0805]
R29  1K8  R-EU_M0805  [M0805]
R30  470  R-EU_M0805  [M0805]
R31  1k  R-EU_M0805  [M0805]
R32  1k8  R-EU_M0805  [M0805]
R33  470  R-EU_M0805  [M0805]
R34  1k  R-EU_M0805  [M0805]
R35  1k8  R-EU_M0805  [M0805]
R36  47  R-EU_M0805  [M0805]
R37  47  R-EU_M0805  [M0805]
R38  120  R-EU_M0805  [M0805]
R39  120  R-EU_M0805  [M0805]
R40  120  R-EU_M0805  [M0805]
R41  120  R-EU_M0805  [M0805]
R42  2k  R-EU_M0805  [M0805]
R43  2k  R-EU_M0805  [M0805]
R44  2k  R-EU_M0805  [M0805]
R45  2k  R-EU_M0805  [M0805]

### Nets
+5V: C56.2 C57.2 CON4.1-4 CON4.2-4 R42.1 R43.1 R44.1 R45.1 ; also sheet 1,2
AUDIO_L: R24.1 ; also sheet 1
AUDIO_R: R23.1 ; also sheet 1
DMACK: CON1.44(/DMACK) JP17.1 R19.1
F_RESET: JP18.1 R22.2 ; also sheet 1
GND: C52.2 C53.2 C54.2 C55.2 C56.1 C57.1 CON1.1(GND1) CON1.8(A10) CON1.10(A09) CON1.11(A08) CON1.12(A07) CON1.14(A06) CON1.15(A05) CON1.16(A04) CON1.17(A03) CON1.50(GND2) CON2.1 CON3.3 CON3.6 CON3.S1(SHIELD) CON4.1-3 CON4.2-3 CON4.6 CON4.7 CON4.8 CON4.10 CON4.11 CON4.12 CON4.S1(SHIELD) CON4.S2(SHIELD) CON4.S3(SHIELD) CON4.S4(SHIELD) CON4.S5(SHIELD) CON4.S6(SHIELD) D1.1(A) D2.1(A) D3.1(A) D4.1(A) IC11.15(GND) JP20.5 R20.2 R21.2 ; also sheet 1,2
IDE_CS0: CON1.7(/CS0) ; also sheet 1
IDE_CS1: CON1.32(/CS1) ; also sheet 1
IDE_D0: CON1.21(D00) ; also sheet 1
IDE_D1: CON1.22(D01) ; also sheet 1
IDE_D2: CON1.23(D02) ; also sheet 1
IDE_D3: CON1.2(D03) ; also sheet 1
IDE_D4: CON1.3(D04) ; also sheet 1
IDE_D5: CON1.4(D05) ; also sheet 1
IDE_D6: CON1.5(D06) ; also sheet 1
IDE_D7: CON1.6(D07) ; also sheet 1
IDE_D8: CON1.47(D08) ; also sheet 1
IDE_D9: CON1.48(D09) ; also sheet 1
IDE_D10: CON1.49(D10) ; also sheet 1
IDE_D11: CON1.27(D11) ; also sheet 1
IDE_D12: CON1.28(D12) ; also sheet 1
IDE_D13: CON1.29(D13) ; also sheet 1
IDE_D14: CON1.30(D14) ; also sheet 1
IDE_D15: CON1.31(D15) ; also sheet 1
IDE_DASP: CON1.45(/DASP) R18.1 R25.1
IDE_IA0: CON1.20(A00) ; also sheet 1
IDE_IA1: CON1.19(A01) ; also sheet 1
IDE_IA2: CON1.18(A02) ; also sheet 1
IDE_INT: CON1.37(INTRQ) ; also sheet 1
IDE_IOCS16: CON1.24(/IOCS16) R14.1
IDE_IORDY: CON1.42(IORDY) R13.1
IDE_PDIAG: CON1.46(/PDIAG) R17.1
IDE_PRESENT: CON1.25(/CD2) R26.1
IDE_RD: CON1.34(/IORD) ; also sheet 1
IDE_VS1: CON1.33(/VS1) R15.1
IDE_VS2: CON1.40(/VS2) R16.1
IDE_WR: CON1.35(/IOWR) ; also sheet 1
KEY_CLK: D2.3(AC) R39.1 ; also sheet 1
KEY_DAT: D1.3(AC) R38.1 ; also sheet 1
MOUSE_CLK: D4.3(AC) R41.1 ; also sheet 1
MOUSE_DAT: D3.3(AC) R40.1 ; also sheet 1
N$1: C50.2 IC11.1(C1+)
N$2: LED3.C R25.2
N$3: C50.1 IC11.3(C1-)
N$4: C49.2 IC11.4(C2+)
N$6: C49.1 IC11.5(C2-)
N$7: C52.1 IC11.6(V-)
N$8: C51.2 IC11.2(V+)
N$9: LED4.C R26.2
N$10: IC11.8(R2IN) JP20.2
N$11: IC11.13(R1IN) JP20.8
N$12: IC11.7(T2OUT) JP20.3
N$13: CON4.1 R27.2 R28.2 R29.2
N$14: CON4.2 R30.2 R31.2 R32.2
N$17: CON4.3 R33.2 R34.2 R35.2
N$18: CON4.13 R37.1
N$19: CON4.14 R36.1
N$20: CON4.1-1 R38.2 R42.2
N$21: CON4.1-5 R39.2 R44.2
N$22: CON4.2-1 R40.2 R43.2
N$23: CON4.2-5 R41.2 R45.2
N$27: CON1.39(/CSEL) R21.1
N$28: CON1.9(/ATASEL) R20.1
N$29: C54.1 CON2.5 R23.2
N$30: C55.1 CON2.2 R24.2
N$35: IC11.14(T1OUT) JP20.7
N$38: CON1.41(/RESET) JP19.1 R22.1
N$39: CON1.43(/DMARQ) JP22.1
N$43: CON1.26(/CD1) JP21.1
N$45: CON3.8 JP23.1
N$46: CON3.9 JP24.1
N$47: CON3.CD(COM_TERM) JP25.1
N$48: CON3.WP(WRITE_PROT) JP26.1
S1_CTS: IC11.12(R1OUT) ; also sheet 1
S1_RTS: IC11.11(T1IN) ; also sheet 1
S1_RXD: IC11.9(R2OUT) ; also sheet 1
S1_TXD: IC11.10(T2IN) ; also sheet 1
SD0_CS: CON3.1 ; also sheet 1
SD0_DI: CON3.2 ; also sheet 1
SD0_DO: CON3.7 ; also sheet 1
SD0_SCLK: CON3.5 ; also sheet 1
VCC: C51.1 C53.1 CON1.13(VCC2) CON1.36(/WE) CON1.38(VCC1) CON3.4 D1.2(C) D2.2(C) D3.2(C) D4.2(C) IC11.16(VCC) LED3.A LED4.A R13.2 R14.2 R15.2 R16.2 R17.2 R18.2 R19.2 ; also sheet 1,2
VGA_BL0: R35.1 ; also sheet 1
VGA_BL1: R34.1 ; also sheet 1
VGA_BL2: R33.1 ; also sheet 1
VGA_GR0: R32.1 ; also sheet 1
VGA_GR1: R31.1 ; also sheet 1
VGA_GR2: R30.1 ; also sheet 1
VGA_HSYNC: R37.2 ; also sheet 1
VGA_RD0: R29.1 ; also sheet 1
VGA_RD1: R28.1 ; also sheet 1
VGA_RD2: R27.1 ; also sheet 1
VGA_VSYNC: R36.2 ; also sheet 1
Unconnected: CON2.3 CON2.4 CON4.1-2 CON4.1-6 CON4.2-2 CON4.2-6 CON4.4 CON4.5 CON4.9 CON4.15 JP20.1 JP20.4 JP20.6 JP20.9 JP20.10

### Notes on the sheet
- SERIAL
- VGA
- RXD
- TXD
- CTS
- RTS
- Keyboard
- Mouse
- SD-CARD
- TRUE IDE
- Master

## Sheet 4 of 4
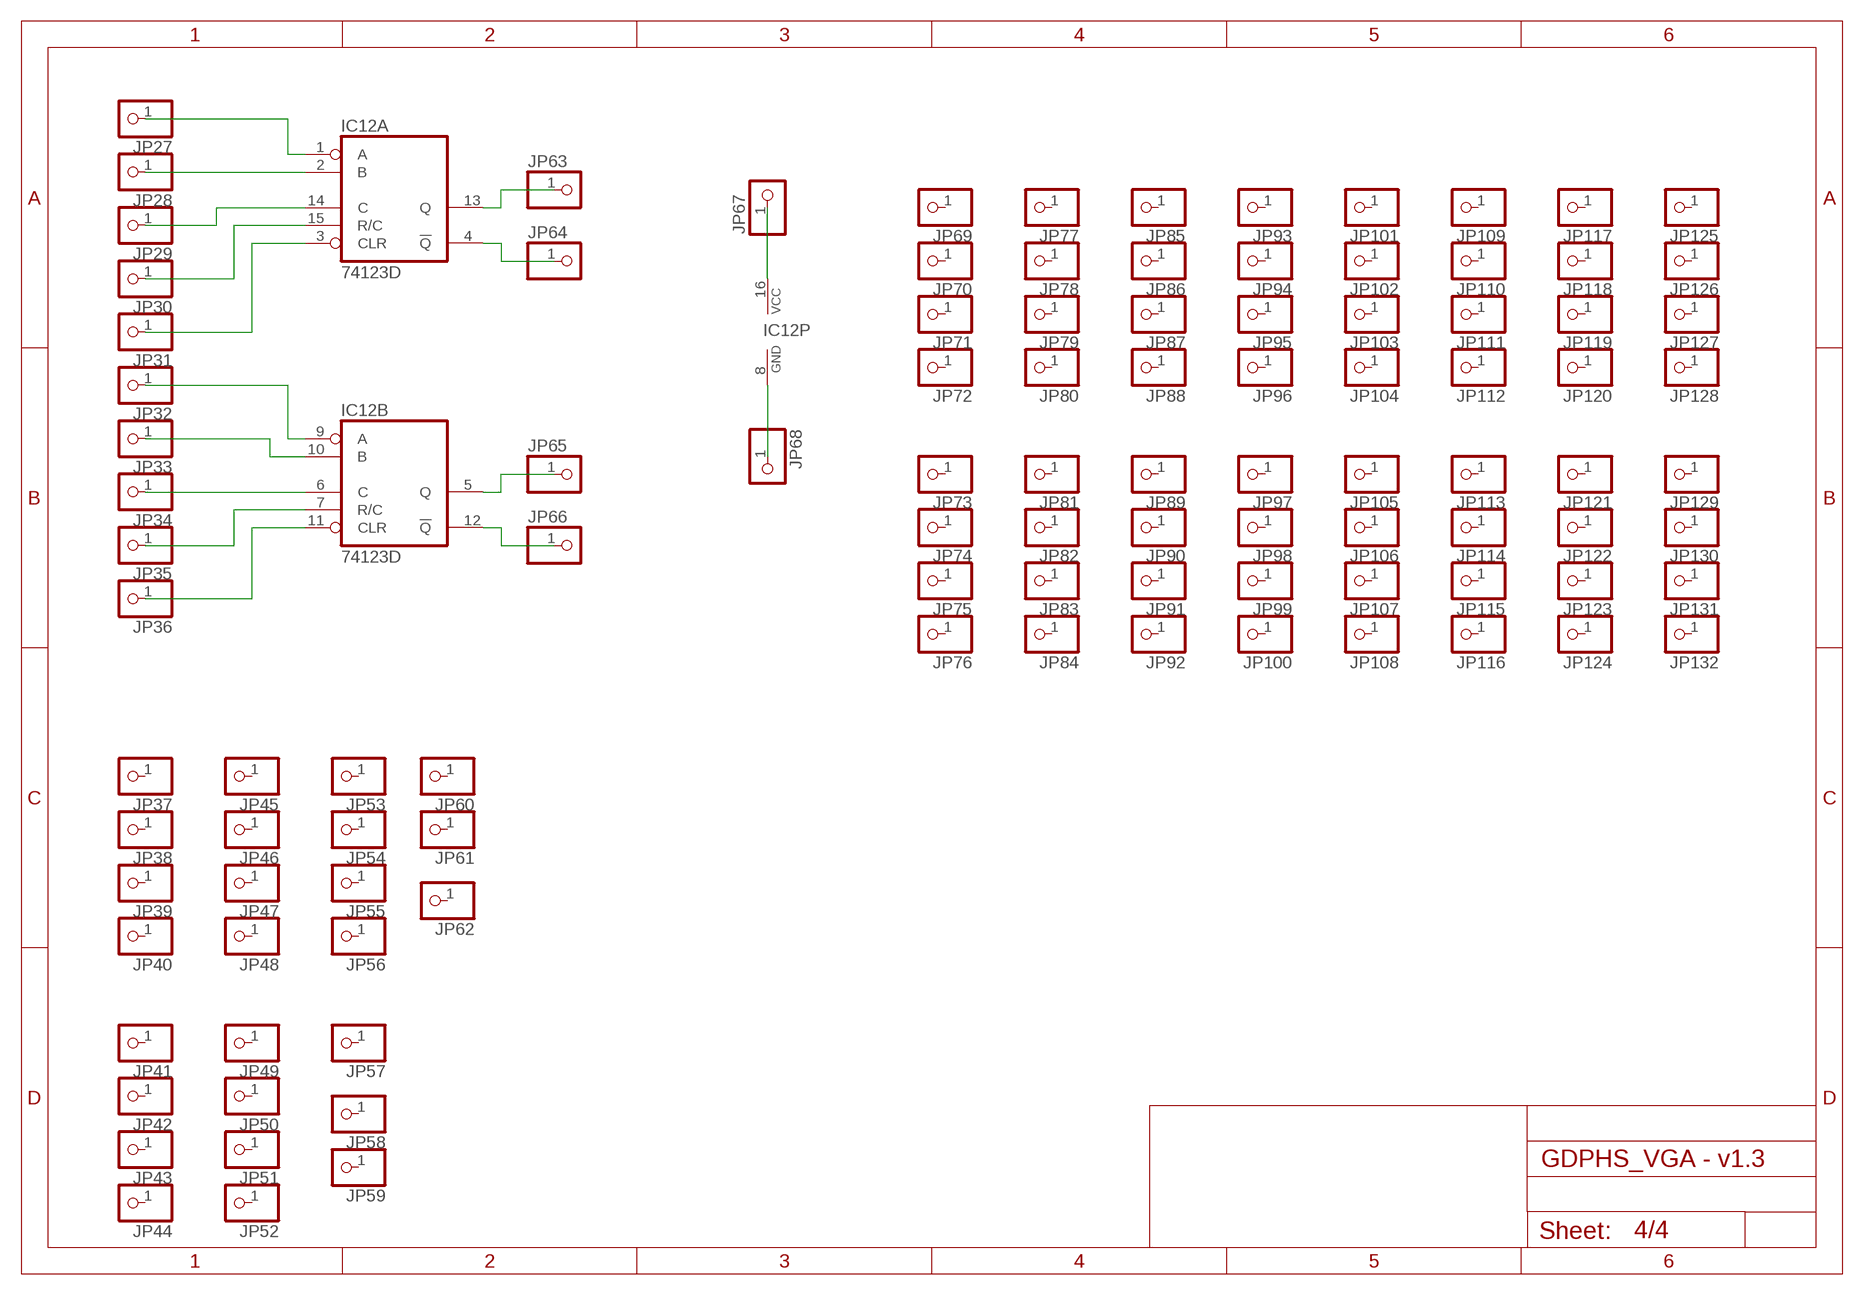
[diagram p4: schematic, sheet 4]

### Parts
IC12  74123D  [SO16]
JP27  PINHD-1X1  [1X01]
JP28  PINHD-1X1  [1X01]
JP29  PINHD-1X1  [1X01]
JP30  PINHD-1X1  [1X01]
JP31  PINHD-1X1  [1X01]
JP32  PINHD-1X1  [1X01]
JP33  PINHD-1X1  [1X01]
JP34  PINHD-1X1  [1X01]
JP35  PINHD-1X1  [1X01]
JP36  PINHD-1X1  [1X01]
JP37  PINHD-1X1  [1X01]
JP38  PINHD-1X1  [1X01]
JP39  PINHD-1X1  [1X01]
JP40  PINHD-1X1  [1X01]
JP41  PINHD-1X1  [1X01]
JP42  PINHD-1X1  [1X01]
JP43  PINHD-1X1  [1X01]
JP44  PINHD-1X1  [1X01]
JP45  PINHD-1X1  [1X01]
JP46  PINHD-1X1  [1X01]
JP47  PINHD-1X1  [1X01]
JP48  PINHD-1X1  [1X01]
JP49  PINHD-1X1  [1X01]
JP50  PINHD-1X1  [1X01]
JP51  PINHD-1X1  [1X01]
JP52  PINHD-1X1  [1X01]
JP53  PINHD-1X1  [1X01]
JP54  PINHD-1X1  [1X01]
JP55  PINHD-1X1  [1X01]
JP56  PINHD-1X1  [1X01]
JP57  PINHD-1X1  [1X01]
JP58  PINHD-1X1  [1X01]
JP59  PINHD-1X1  [1X01]
JP60  PINHD-1X1  [1X01]
JP61  PINHD-1X1  [1X01]
JP62  PINHD-1X1  [1X01]
JP63  PINHD-1X1  [1X01]
JP64  PINHD-1X1  [1X01]
JP65  PINHD-1X1  [1X01]
JP66  PINHD-1X1  [1X01]
JP67  PINHD-1X1  [1X01]
JP68  PINHD-1X1  [1X01]
JP69  PINHD-1X1  [1X01]
JP70  PINHD-1X1  [1X01]
JP71  PINHD-1X1  [1X01]
JP72  PINHD-1X1  [1X01]
JP73  PINHD-1X1  [1X01]
JP74  PINHD-1X1  [1X01]
JP75  PINHD-1X1  [1X01]
JP76  PINHD-1X1  [1X01]
JP77  PINHD-1X1  [1X01]
JP78  PINHD-1X1  [1X01]
JP79  PINHD-1X1  [1X01]
JP80  PINHD-1X1  [1X01]
JP81  PINHD-1X1  [1X01]
JP82  PINHD-1X1  [1X01]
JP83  PINHD-1X1  [1X01]
JP84  PINHD-1X1  [1X01]
JP85  PINHD-1X1  [1X01]
JP86  PINHD-1X1  [1X01]
JP87  PINHD-1X1  [1X01]
JP88  PINHD-1X1  [1X01]
JP89  PINHD-1X1  [1X01]
JP90  PINHD-1X1  [1X01]
JP91  PINHD-1X1  [1X01]
JP92  PINHD-1X1  [1X01]
JP93  PINHD-1X1  [1X01]
JP94  PINHD-1X1  [1X01]
JP95  PINHD-1X1  [1X01]
JP96  PINHD-1X1  [1X01]
JP97  PINHD-1X1  [1X01]
JP98  PINHD-1X1  [1X01]
JP99  PINHD-1X1  [1X01]
JP100  PINHD-1X1  [1X01]
JP101  PINHD-1X1  [1X01]
JP102  PINHD-1X1  [1X01]
JP103  PINHD-1X1  [1X01]
JP104  PINHD-1X1  [1X01]
JP105  PINHD-1X1  [1X01]
JP106  PINHD-1X1  [1X01]
JP107  PINHD-1X1  [1X01]
JP108  PINHD-1X1  [1X01]
JP109  PINHD-1X1  [1X01]
JP110  PINHD-1X1  [1X01]
JP111  PINHD-1X1  [1X01]
JP112  PINHD-1X1  [1X01]
JP113  PINHD-1X1  [1X01]
JP114  PINHD-1X1  [1X01]
JP115  PINHD-1X1  [1X01]
JP116  PINHD-1X1  [1X01]
JP117  PINHD-1X1  [1X01]
JP118  PINHD-1X1  [1X01]
JP119  PINHD-1X1  [1X01]
JP120  PINHD-1X1  [1X01]
JP121  PINHD-1X1  [1X01]
JP122  PINHD-1X1  [1X01]
JP123  PINHD-1X1  [1X01]
JP124  PINHD-1X1  [1X01]
JP125  PINHD-1X1  [1X01]
JP126  PINHD-1X1  [1X01]
JP127  PINHD-1X1  [1X01]
JP128  PINHD-1X1  [1X01]
JP129  PINHD-1X1  [1X01]
JP130  PINHD-1X1  [1X01]
JP131  PINHD-1X1  [1X01]
JP132  PINHD-1X1  [1X01]

### Nets
N$40: IC12.1(A:A) JP27.1
N$44: IC12.2(A:B) JP28.1
N$50: IC12.14(A:C) JP29.1
N$51: IC12.15(A:R/C) JP30.1
N$52: IC12.3(A:CLR) JP31.1
N$53: IC12.13(A:Q) JP63.1
N$54: IC12.4(A:!Q) JP64.1
N$55: IC12.9(B:A) JP32.1
N$56: IC12.10(B:B) JP33.1
N$57: IC12.6(B:C) JP34.1
N$58: IC12.16(P:VCC) JP67.1
N$59: IC12.8(P:GND) JP68.1
N$60: IC12.7(B:R/C) JP35.1
N$61: IC12.11(B:CLR) JP36.1
N$62: IC12.5(B:Q) JP65.1
N$63: IC12.12(B:!Q) JP66.1
Unconnected: JP37.1 JP38.1 JP39.1 JP40.1 JP41.1 JP42.1 JP43.1 JP44.1 JP45.1 JP46.1 JP47.1 JP48.1 JP49.1 JP50.1 JP51.1 JP52.1 JP53.1 JP54.1 JP55.1 JP56.1 JP57.1 JP58.1 JP59.1 JP60.1 JP61.1 JP62.1 JP69.1 JP70.1 JP71.1 JP72.1 JP73.1 JP74.1 JP75.1 JP76.1 JP77.1 JP78.1 JP79.1 JP80.1 JP81.1 JP82.1 JP83.1 JP84.1 JP85.1 JP86.1 JP87.1 JP88.1 JP89.1 JP90.1 JP91.1 JP92.1 JP93.1 JP94.1 JP95.1 JP96.1 JP97.1 JP98.1 JP99.1 JP100.1 JP101.1 JP102.1 JP103.1 JP104.1 JP105.1 JP106.1 JP107.1 JP108.1 JP109.1 JP110.1 JP111.1 JP112.1 JP113.1 JP114.1 JP115.1 JP116.1 JP117.1 JP118.1 JP119.1 JP120.1 JP121.1 JP122.1 JP123.1 JP124.1 JP125.1 JP126.1 JP127.1 JP128.1 JP129.1 JP130.1 JP131.1 JP132.1

## Power pins joined to a net without a drawn wire
GND: IC1.10(GND) IC2.10(GND) IC3.10(GND) IC4.10(GND) IC5.10(GND)
VCC: IC1.20(VCC) IC2.20(VCC) IC3.20(VCC) IC4.20(VCC) IC5.20(VCC)

## Library data of the parts
C1-C3 C5 C6 C8 C10 C13 C14 C16 C17 C21 C23 C25-C29 C31-C57 = rcl:C-EU: CAPACITOR, European symbol
C4 C7 C9 C11 C12 C15 C18-C20 C22 C24 C30 = rcl:CPOL-EU: POLARIZED CAPACITOR, European symbol
CON1 = con-hirose:CF-CARD-IDE_MODE: Compact Flash Adapter Type I or II without Eject Button Source: con-hirose.lbr from Bob Starr <rtzaudio@mindspring.com>; MF: Yamaichi; MPN: CF-050P2-103-10-DS1; OC_REICHELT: CONNECTOR CF 02
CON2 = con-hirschmann:PG203J: MIC/HEADPHONE JACK KS-S stereo microphone/headphone jack PG203JN (Schukat); OC_FARNELL: unknown; OC_NEWARK: unknown; OC_REICHELT: EBS 35 BL
CON3 = dummy:FPS-009-2405-0: YAMAI SD Card - FPS Series 009-2405-0; MF: Yamaichi; MPN: FPS-009-2405-0; OC_REICHELT: CONNECTOR SD 22
CON4 = dummy:MDSSV-BD06-HF15; MF: Norcomp Inc.; MPN: 999-H15-PS2L571; OC_DIGIKEY: 999-H15FA-ND
D1-D4 = diode:DIODE_2CACA-: 2 Diodes - Cathode-Anode|Cathode-Anode
IC1-IC5 = 74xx-eu:74*245: Octal BUS TRANSCEIVER, 3-state; MF: Texas Instruments; MPN: SN74LVC245ADWR; OC_DIGIKEY: 296-1232-1-ND
IC6 = Xilinx:XC9536; MF: Xilinx; MPN: XC9536-7VQ44C; OC_DIGIKEY: 122-1170-ND
IC7 = dummy:LFXP6C_XX208-2; MF: Lattice Semiconductor; MPN: LFXP6C-3QN208C; OC_DIGIKEY: 220-1261-ND
IC8 IC9 = cypress:CY7C1041CV33-; MF: Cypress; MPN: CY7C1041CV33-10ZSXA; OC_DIGIKEY: CY7C1041CV33-10ZSXA-ND
IC10 = linear-technology:LT1086; MF: Linear Technology; MPN: LT1086CM-3.3#PBF; OC_DIGIKEY: LT1086CM-3.3#PBF-ND
IC11 = maxim:MAX232ECWE: RS232 TRANSEIVER; MF: MAXIM; MPN: MAX232ECWE+; OC_FARNELL: 9724435; OC_NEWARK: 67K4440
IC12 = 74xx-eu:74*123: Retriggerable monostable MULTIVIBRATOR
J1 = 19inch:VG96: PCB EUROCARD, 96-pin type C/ABC, 2.54 mm; OC_REICHELT: ML-C 96W
JP1-JP14 JP17-JP19 JP21-JP132 = pinhead:PINHD-1X1: PIN HEADER
JP15 = con-lstb:MA06-1: PIN HEADER; OC_FARNELL: unknown; OC_NEWARK: unknown
JP16 = con-lstb:MA05-2: PIN HEADER; OC_FARNELL: unknown; OC_NEWARK: unknown
JP20 = pinhead:PINHD-2X5: PIN HEADER
LED1 LED4 = led:LED: LED OSRAM: - CHIPLED LG R971, LG N971, LY N971, LG Q971, LY Q971, LO R971, LY R971 LH N974, LH R974 LS Q976, LO Q976, LY Q976 LO Q996 - Hyper CHIPLED LW Q18S LB Q993, LB Q99A, LB R99A - SideLED LS A670, LO A670, LY A670, LG A670, LP A670 LB A673, LV A673, LT A673, LW A673 LH A674 LY A675 LS A676, LA A676, LO A676, LY A676, LW A676 LS A679, LY A679, LG A679 - Hyper Micro SIDELED® LS Y876, LA Y876, LO Y876, LY Y876 LT Y87S - SmartLED LW L88C, LW L88S LB L89C, LB L89S, LG L890 LS L89K, LO L89K, LY L89K LS L896, LA L896, LO L896, LY L896 - TOPLED LS T670, LO T670, LY T670, LG T670, LP T670 LSG T670, LSP T670, LSY T670, LOP T670, LYG T670 LG T671, LOG T671, LSG T671 LB T673, LV T673, LT T673, LW T673 LH T674 LS T676, LA T676, LO T676, LY T676, LB T676, LH T676, LSB T676, LW T676 LB T67C, LV T67C, LT T67C, LS T67K, LO T67K, LY T67K, LW E67C LS E67B, LA E67B, LO E67B, LY E67B, LB E67C, LV E67C, LT E67C LW T67C LS T679, LY T679, LG T679 LS T770, LO T770, LY T770, LG T770, LP T770 LB T773, LV T773, LT T773, LW T773 LH T774 LS E675, LA E675, LY E675, LS T675 LS T776, LA T776, LO T776, LY T776, LB T776 LHGB T686 LT T68C, LB T68C - Hyper Mini TOPLED® LB M676 - Mini TOPLED Santana® LG M470 LS M47K, LO M47K, LY M47K Source: http://www.osram.convergy.de LUXEON: - LUMILED® LXK2-PW12-R00, LXK2-PW12-S00, LXK2-PW14-U00, LXK2-PW14-V00 LXK2-PM12-R00, LXK2-PM12-S00, LXK2-PM14-U00 LXK2-PE12-Q00, LXK2-PE12-R00, LXK2-PE12-S00, LXK2-PE14-T00, LXK2-PE14-U00 LXK2-PB12-K00, LXK2-PB12-L00, LXK2-PB12-M00, LXK2-PB14-N00, LXK2-PB14-P00, LXK2-PB14-Q00 LXK2-PR12-L00, LXK2-PR12-M00, LXK2-PR14-Q00, LXK2-PR14-R00 LXK2-PD12-Q00, LXK2-PD12-R00, LXK2-PD12-S00 LXK2-PH12-R00, LXK2-PH12-S00 LXK2-PL12-P00, LXK2-PL12-Q00, LXK2-PL12-R00 Source: www.luxeon.com KINGBRIGHT: KA-3528ASYC Source: www.kingbright.com; OC_REICHELT: SMD-LED 1206 GE
LED2 = led:LED: LED OSRAM: - CHIPLED LG R971, LG N971, LY N971, LG Q971, LY Q971, LO R971, LY R971 LH N974, LH R974 LS Q976, LO Q976, LY Q976 LO Q996 - Hyper CHIPLED LW Q18S LB Q993, LB Q99A, LB R99A - SideLED LS A670, LO A670, LY A670, LG A670, LP A670 LB A673, LV A673, LT A673, LW A673 LH A674 LY A675 LS A676, LA A676, LO A676, LY A676, LW A676 LS A679, LY A679, LG A679 - Hyper Micro SIDELED® LS Y876, LA Y876, LO Y876, LY Y876 LT Y87S - SmartLED LW L88C, LW L88S LB L89C, LB L89S, LG L890 LS L89K, LO L89K, LY L89K LS L896, LA L896, LO L896, LY L896 - TOPLED LS T670, LO T670, LY T670, LG T670, LP T670 LSG T670, LSP T670, LSY T670, LOP T670, LYG T670 LG T671, LOG T671, LSG T671 LB T673, LV T673, LT T673, LW T673 LH T674 LS T676, LA T676, LO T676, LY T676, LB T676, LH T676, LSB T676, LW T676 LB T67C, LV T67C, LT T67C, LS T67K, LO T67K, LY T67K, LW E67C LS E67B, LA E67B, LO E67B, LY E67B, LB E67C, LV E67C, LT E67C LW T67C LS T679, LY T679, LG T679 LS T770, LO T770, LY T770, LG T770, LP T770 LB T773, LV T773, LT T773, LW T773 LH T774 LS E675, LA E675, LY E675, LS T675 LS T776, LA T776, LO T776, LY T776, LB T776 LHGB T686 LT T68C, LB T68C - Hyper Mini TOPLED® LB M676 - Mini TOPLED Santana® LG M470 LS M47K, LO M47K, LY M47K Source: http://www.osram.convergy.de LUXEON: - LUMILED® LXK2-PW12-R00, LXK2-PW12-S00, LXK2-PW14-U00, LXK2-PW14-V00 LXK2-PM12-R00, LXK2-PM12-S00, LXK2-PM14-U00 LXK2-PE12-Q00, LXK2-PE12-R00, LXK2-PE12-S00, LXK2-PE14-T00, LXK2-PE14-U00 LXK2-PB12-K00, LXK2-PB12-L00, LXK2-PB12-M00, LXK2-PB14-N00, LXK2-PB14-P00, LXK2-PB14-Q00 LXK2-PR12-L00, LXK2-PR12-M00, LXK2-PR14-Q00, LXK2-PR14-R00 LXK2-PD12-Q00, LXK2-PD12-R00, LXK2-PD12-S00 LXK2-PH12-R00, LXK2-PH12-S00 LXK2-PL12-P00, LXK2-PL12-Q00, LXK2-PL12-R00 Source: www.luxeon.com KINGBRIGHT: KA-3528ASYC Source: www.kingbright.com; OC_REICHELT: SMD-LED 1206 GN
LED3 = led:LED: LED OSRAM: - CHIPLED LG R971, LG N971, LY N971, LG Q971, LY Q971, LO R971, LY R971 LH N974, LH R974 LS Q976, LO Q976, LY Q976 LO Q996 - Hyper CHIPLED LW Q18S LB Q993, LB Q99A, LB R99A - SideLED LS A670, LO A670, LY A670, LG A670, LP A670 LB A673, LV A673, LT A673, LW A673 LH A674 LY A675 LS A676, LA A676, LO A676, LY A676, LW A676 LS A679, LY A679, LG A679 - Hyper Micro SIDELED® LS Y876, LA Y876, LO Y876, LY Y876 LT Y87S - SmartLED LW L88C, LW L88S LB L89C, LB L89S, LG L890 LS L89K, LO L89K, LY L89K LS L896, LA L896, LO L896, LY L896 - TOPLED LS T670, LO T670, LY T670, LG T670, LP T670 LSG T670, LSP T670, LSY T670, LOP T670, LYG T670 LG T671, LOG T671, LSG T671 LB T673, LV T673, LT T673, LW T673 LH T674 LS T676, LA T676, LO T676, LY T676, LB T676, LH T676, LSB T676, LW T676 LB T67C, LV T67C, LT T67C, LS T67K, LO T67K, LY T67K, LW E67C LS E67B, LA E67B, LO E67B, LY E67B, LB E67C, LV E67C, LT E67C LW T67C LS T679, LY T679, LG T679 LS T770, LO T770, LY T770, LG T770, LP T770 LB T773, LV T773, LT T773, LW T773 LH T774 LS E675, LA E675, LY E675, LS T675 LS T776, LA T776, LO T776, LY T776, LB T776 LHGB T686 LT T68C, LB T68C - Hyper Mini TOPLED® LB M676 - Mini TOPLED Santana® LG M470 LS M47K, LO M47K, LY M47K Source: http://www.osram.convergy.de LUXEON: - LUMILED® LXK2-PW12-R00, LXK2-PW12-S00, LXK2-PW14-U00, LXK2-PW14-V00 LXK2-PM12-R00, LXK2-PM12-S00, LXK2-PM14-U00 LXK2-PE12-Q00, LXK2-PE12-R00, LXK2-PE12-S00, LXK2-PE14-T00, LXK2-PE14-U00 LXK2-PB12-K00, LXK2-PB12-L00, LXK2-PB12-M00, LXK2-PB14-N00, LXK2-PB14-P00, LXK2-PB14-Q00 LXK2-PR12-L00, LXK2-PR12-M00, LXK2-PR14-Q00, LXK2-PR14-R00 LXK2-PD12-Q00, LXK2-PD12-R00, LXK2-PD12-S00 LXK2-PH12-R00, LXK2-PH12-S00 LXK2-PL12-P00, LXK2-PL12-Q00, LXK2-PL12-R00 Source: www.luxeon.com KINGBRIGHT: KA-3528ASYC Source: www.kingbright.com; OC_REICHELT: SMD-LED 1206 RT
OSZI1 = dummy:CRYSTAL_RESONATOR: CRYSTAL RESONATOR; MF: IQD FREQUENCY PRODUCTS; MPN: LF SPXO018042 - QUARZ, 40MHZ, 15PF, SMD; OC_FARNELL: 9713565
R1-R45 = rcl:R-EU_: RESISTOR, European symbol
T1 = transistor-small-signal:BSS123: N-CHANNEL MOS FET; MF: Fairchild Semiconductor; MPN: BSS138; OC_REICHELT: BSS 138 SMD